# EAGLE design watchdog timer (EAGLE 6.5.0)
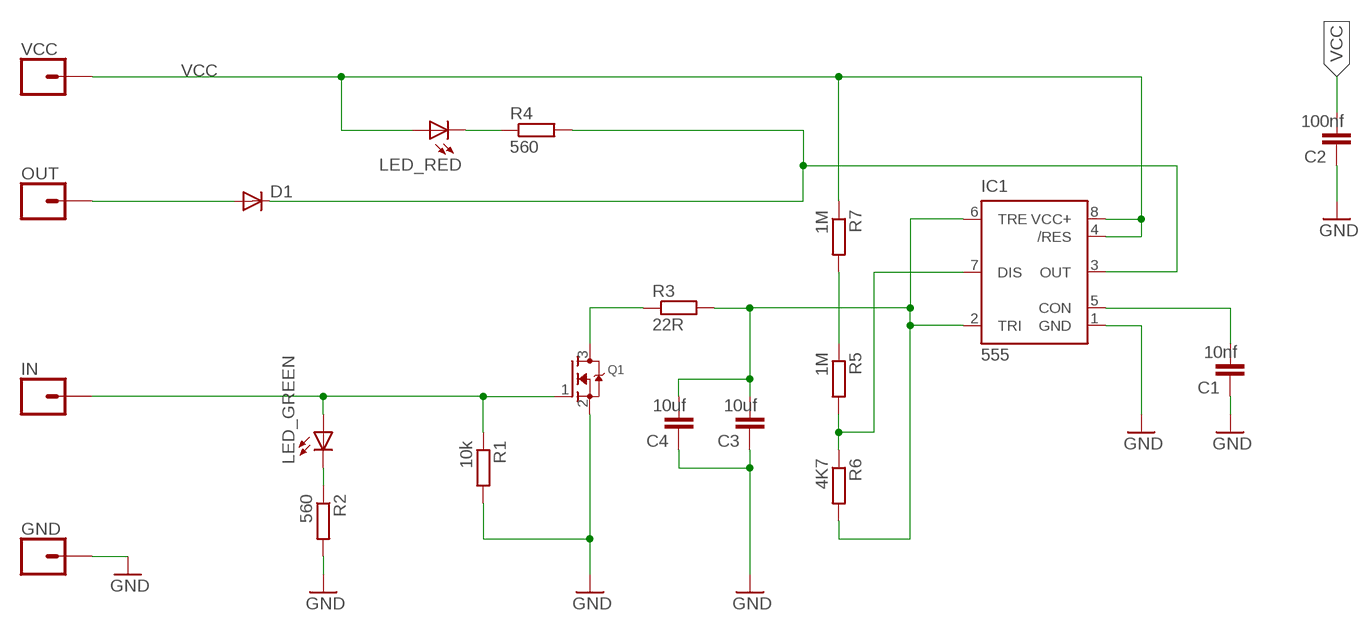
[diagram p0: schematic, sheet 1]

## Parts
C1  10nf  C-EUC1206  [C1206]
C2  100nf  C-EUC1206  [C1206]
C3  10uf  C-EUC1206  [C1206]
C4  10uf  C-EUC1206  [C1206]
D1  DIODE-SOD323-W  [SOD323-W]
GND  CONN_01  [1X01]
IC1  555  555D  [SO08]
IN  CONN_01  [1X01]
LED_GREEN  LEDSML0805  [SML0805]
LED_RED  LEDSML0805  [SML0805]
OUT  CONN_01  [1X01]
Q1  MOSFET-NREFLOW  [SOT23]
R1  10k  R-EU_M0805  [M0805]
R2  560  R-EU_M0805  [M0805]
R3  22R  R-EU_M0805  [M0805]
R4  560  R-EU_M0805  [M0805]
R5  1M  R-EU_M0805  [M0805]
R6  4K7  R-EU_M0805  [M0805]
R7  1M  R-EU_M0805  [M0805]
VCC  CONN_01  [1X01]

## Nets
GND: C1.1 C2.1 C3.1 C4.1 GND.1 IC1.1(GND) Q1.2(S) R1.2 R2.2
IN: IN.1 LED_GREEN.A Q1.1(G) R1.1
N$1: IC1.7(DIS) R5.2 R6.1
N$2: LED_GREEN.C R2.1
N$3: R5.1 R7.2
N$4: D1.A OUT.1
N$5: C1.2 IC1.5(CON)
N$6: D1.C IC1.3(OUT) R4.2
N$8: Q1.3(D) R3.1
N$9: C3.2 C4.2 IC1.2(TRI) IC1.6(TRE) R3.2 R6.2
N$11: LED_RED.C R4.1
VCC: C2.2 IC1.4(/RES) IC1.8(VCC+) LED_RED.A R7.1 VCC.1

## Library data of the parts
C1-C4 = rcl:C-EU: CAPACITOR, European symbol
D1 = diode:DIODE-: DIODE
GND IN OUT VCC = SparkFun-Connectors:CONN_01: Single connection point. Often used as Generic Header-pin footprint for 0.1 inch spaced/style header connections On any of the 0.1 inch spaced packages, you can populate with these: Break Away Headers - Straight <https://www.sparkfun.com/products/116> (PRT-00116) Break Away Male Headers - Right Angle <https://www.sparkfun.com/products/553> (PRT-00553) Female Headers <https://www.sparkfun.com/products/115> (PRT-00115) Break Away Headers - Machine Pin <https://www.sparkfun.com/products/117> (PRT-00117) Break Away Female Headers - Swiss Machine Pin <https://www.sparkfun.com/products/743> (PRT-00743) This device is also useful as a general connection point to wire up your design to another part of your project. Our various solder wires solder well into these plated through hole pads. Hook-Up Wire - Assortment (Stranded, 22 AWG) <https://www.sparkfun.com/products/11375> (PRT-11375) Hook-Up Wire - Assortment (Solid Core, 22 AWG) <https://www.sparkfun.com/products/11367> (PRT-11367) View the entire wire category on our website here <https://www.sparkfun.com/categories/141> Special notes: SMTSO-256-ET is a "flush mount" nut for a 4-40 screw. We mostly use this on specialty testbeds; it is a nice way to connect hardware to your PCB at an adjustable hieght. Also note, the SNAP packages are for using a snappable style connector. We sell a baggie of snaps and they are also used on two LilyPad designs: Snap Assortment - 30 pack (male and female) <https://www.sparkfun.com/products/11347> (DEV-11347) LilyPad Arduino SimpleSnap <https://www.sparkfun.com/products/10941> (DEV-10941) LilyPad SimpleSnap Protoboard <https://www.sparkfun.com/products/10940> (DEV-10940)
IC1 = SparkFun-IC-Special-Function:555: General purpose bipolar Timer Datasheet <http://www.sparkfun.com/datasheets/Components/General/ne555.pdf> SparkFun Products SparkFun SparkPunk Sequencer Kit <https://www.sparkfun.com/products/12707> (KIT-12707) Storefront Component: 555 Timer <https://www.sparkfun.com/products/9273> (COM-09273) Two parts valid for production: VFP: IC-11930 (M7555 PTH) VFP: IC-09173 (555 PTH) - Preferred; PROD_ID: NA-XXXXX
LED_GREEN LED_RED = led:LED: LED OSRAM: - CHIPLED LG R971, LG N971, LY N971, LG Q971, LY Q971, LO R971, LY R971 LH N974, LH R974 LS Q976, LO Q976, LY Q976 LO Q996 - Hyper CHIPLED LW Q18S LB Q993, LB Q99A, LB R99A - SideLED LS A670, LO A670, LY A670, LG A670, LP A670 LB A673, LV A673, LT A673, LW A673 LH A674 LY A675 LS A676, LA A676, LO A676, LY A676, LW A676 LS A679, LY A679, LG A679 - Hyper Micro SIDELED® LS Y876, LA Y876, LO Y876, LY Y876 LT Y87S - SmartLED LW L88C, LW L88S LB L89C, LB L89S, LG L890 LS L89K, LO L89K, LY L89K LS L896, LA L896, LO L896, LY L896 - TOPLED LS T670, LO T670, LY T670, LG T670, LP T670 LSG T670, LSP T670, LSY T670, LOP T670, LYG T670 LG T671, LOG T671, LSG T671 LB T673, LV T673, LT T673, LW T673 LH T674 LS T676, LA T676, LO T676, LY T676, LB T676, LH T676, LSB T676, LW T676 LB T67C, LV T67C, LT T67C, LS T67K, LO T67K, LY T67K, LW E67C LS E67B, LA E67B, LO E67B, LY E67B, LB E67C, LV E67C, LT E67C LW T67C LS T679, LY T679, LG T679 LS T770, LO T770, LY T770, LG T770, LP T770 LB T773, LV T773, LT T773, LW T773 LH T774 LS E675, LA E675, LY E675, LS T675 LS T776, LA T776, LO T776, LY T776, LB T776 LHGB T686 LT T68C, LB T68C - Hyper Mini TOPLED® LB M676 - Mini TOPLED Santana® LG M470 LS M47K, LO M47K, LY M47K Source: http://www.osram.convergy.de LUXEON: - LUMILED® LXK2-PW12-R00, LXK2-PW12-S00, LXK2-PW14-U00, LXK2-PW14-V00 LXK2-PM12-R00, LXK2-PM12-S00, LXK2-PM14-U00 LXK2-PE12-Q00, LXK2-PE12-R00, LXK2-PE12-S00, LXK2-PE14-T00, LXK2-PE14-U00 LXK2-PB12-K00, LXK2-PB12-L00, LXK2-PB12-M00, LXK2-PB14-N00, LXK2-PB14-P00, LXK2-PB14-Q00 LXK2-PR12-L00, LXK2-PR12-M00, LXK2-PR14-Q00, LXK2-PR14-R00 LXK2-PD12-Q00, LXK2-PD12-R00, LXK2-PD12-S00 LXK2-PH12-R00, LXK2-PH12-S00 LXK2-PL12-P00, LXK2-PL12-Q00, LXK2-PL12-R00 Source: www.luxeon.com KINGBRIGHT: KA-3528ASYC Source: www.kingbright.com
Q1 = adafruit:MOSFET-N: N-Channel Mosfet 2N7002E - 60V 260mA SOT23 [Digikey: 2N7002ET1GOSTR-ND] - REEL BSH103 - 30V 850mA SOT23 [Digikey: 568-5013-1-ND]
R1-R7 = rcl:R-EU_: RESISTOR, European symbol

## Board
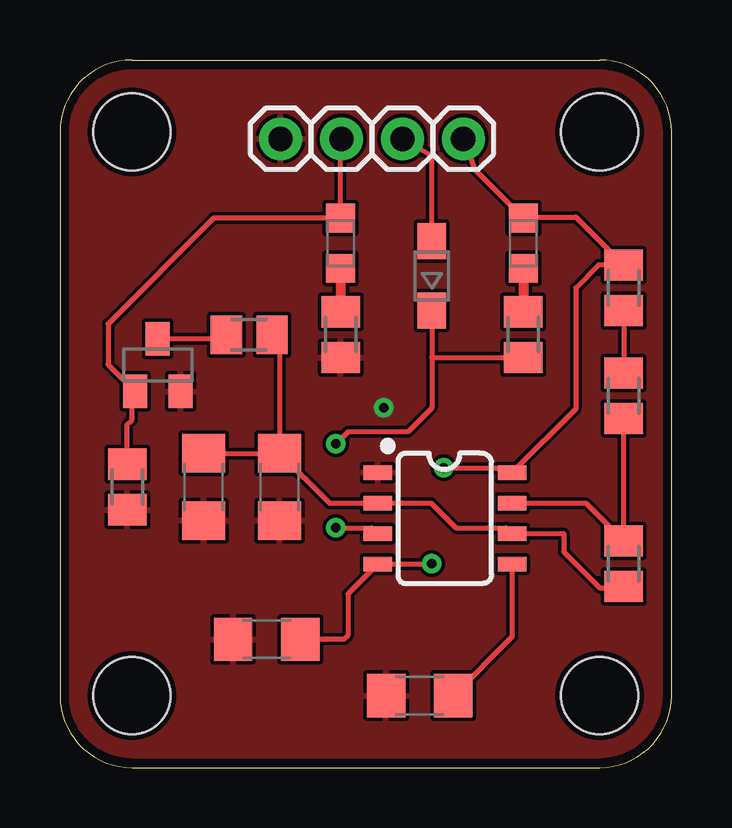
[diagram p1: board, top side]
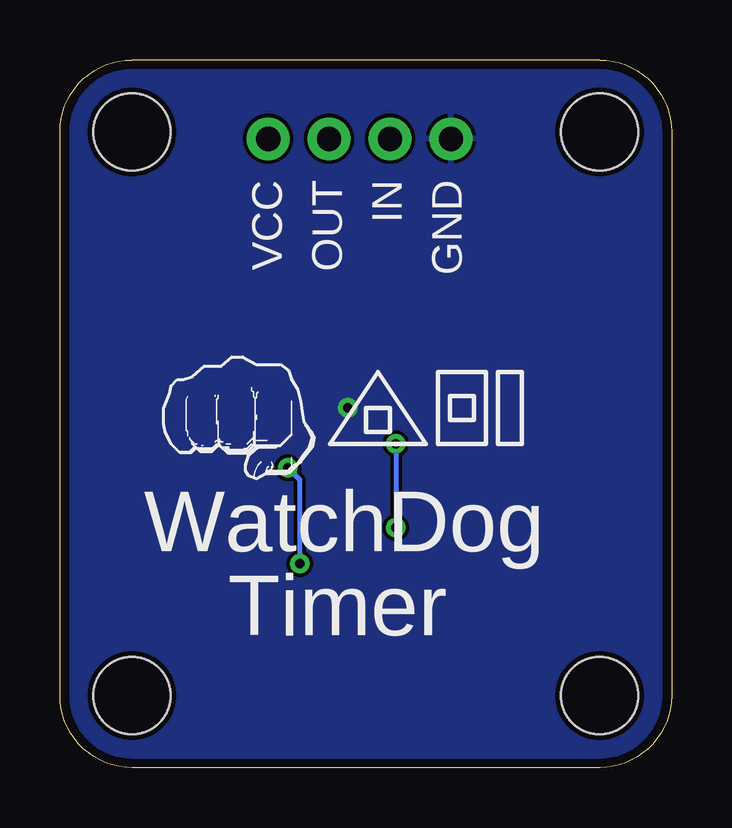
[diagram p2: board, bottom side, seen from below]

Size 25.5 x 29.5 mm. Coordinates in mm from the lower left corner, seen from the top.
Outline: 3,0 22.5,0 arc90 25.5,3 25.5,26.5 arc90 22.5,29.5 3,29.5 arc90 0,26.5 0,3 arc90 3,0
Copper layers (1*16): Top 0.035mm / dielectric 1.5mm / Bottom 0.035mm
Design rules "SeeedStudio_2layer_DRU_no_angle_20140221 *": minimum track width 6mil, minimum drill 12mil, track to track 6mil, track to pad 6mil, pad to pad 6mil, via to via 6mil, smd to smd 0mil, copper to edge 10mil, drill to drill 10mil, minimum pad ring 10mil, minimum via ring 6mil, stop-mask expansion 2mil, vias tented up to drill 100mil, thermal gap 6mil
Holes 3.2 mm at 3,3 3,26.5 22.5,26.5 22.5,3

### Footprints (pad centres in the part's own frame; a part is rotated, then mirrored left to right if it is on the bottom)
C1206 = smd 1.6 x 1.8: 1 -1.4,0; 2 1.4,0
SOD323-W = smd 1.5 x 1.2: A 1.45,0; C -1.45,0
1X01 = drill 1.016 pad 1.778: 1 0,0
SO08 = smd 0.6 x 1.2: 1 -1.905,-2.8; 2 -0.635,-2.8; 3 0.635,-2.8; 4 1.905,-2.8; 5 1.905,2.8; 6 0.635,2.8; 7 -0.635,2.8; 8 -1.905,2.8
SML0805 = smd 1.2 x 1.2: A 1.05,0; C -1.05,0
SOT23 = smd 1 x 1.4: 1 -0.95,-1.1; 2 0.95,-1.1; 3 0,1.1
M0805 = smd 1.3 x 1.6: 1 -0.95,0; 2 0.95,0

### Placement (x,y rotation side)
C1  15,3 0 top
C2  8.62,5.35 0 top
C3  9.16,11.7 90 top
C4  5.99,11.7 90 top
D1  15.5,20.5 90 top
GND  9.2,26.21 0 top
IC1  16.05,10.39 270 top
IN  11.74,26.21 0 top
LED_GREEN  11.7,21.86 90 top
LED_RED  19.32,21.86 90 top
OUT  14.28,26.21 0 top
Q1  4.08,16.78 0 top
R1  2.81,11.7 270 top
R2  11.7,18.05 270 top
R3  7.89,18.05 0 top
R4  19.32,18.05 270 top
R5  23.5,15.5 270 top
R6  23.5,8.5 270 top
R7  23.5,20 270 top
U$1  [ADILOGO]  13.5,13.5 0 bottom
VCC  16.82,26.21 0 top

### Tracks (layer width: path | path; a pad name or v marks a point on that pad's centre or on a via)
GND  (via drill 0.38 pad 0.81)
  other vias: 13.5,15
  pour Top (isolate 0.152): 12,0.5 3,0.5 arc-90 0.5,3 0.5,26.5 arc-90 3,29 22.5,29 arc-90 25,26.5 25,3 arc-90 22.5,0.5
  pour Bottom (isolate 0.152): 14.5,0.5 3,0.5 arc-90 0.5,3 0.5,26.5 arc-90 3,29 22.5,29 arc-90 25,26.5 25,3 arc-90 22.5,0.5
IN
  Top 0.203: R1.1 2.81,14.31 3,14.5 3,15.55 Q1.1 2,16.81 2,18.5 6.41,22.91 LED_GREEN.A 11.7,25.67 IN.1
N$1
  Top 0.203: R5.2 R6.1 21.93,11.03 IC1.7
N$2
  Top 0.406: LED_GREEN.C R2.1
N$3
  Top 0.203: R7.2 R5.1
N$4
  Top 0.203: D1.A 15.5,25.49 OUT.1
N$5
  Top 0.203: IC1.5 18.85,5.45 C1.2
N$6  (via drill 0.38 pad 0.81)
  Top 0.203: D1.C 15.5,17.1 | 15.5,17.1 R4.2 | 15.5,17.1 15.5,15 14.5,14 12,14 v11.5,13.5 | v11.5,10 13.01,10 IC1.3
  Bottom 0.203: v11.5,13.5 v11.5,10
N$8
  Top 0.203: Q1.3 6.94,17.88
  Top 0.406: 6.94,17.88 R3.1
N$9
  Top 0.203: 9.16,18.05 C3.2 | C4.2 C3.2 | C3.2 11.23,11.03 IC1.2 15.47,11.03 16.5,10 18.61,10 IC1.6 21,9.76 21,9 22.5,7.5 23.45,7.5 R6.2
  Top 0.406: R3.2 9.16,18.05
N$11
  Top 0.406: LED_RED.C R4.1
VCC  (via drill 0.38 pad 0.81)
  Top 0.203: LED_RED.A 17.32,24.91 VCC.1 | 19.36,22.95 21.5,22.95 R7.1 22.45,20.95 21.5,20 21.5,14.95 IC1.8 18.64,12.5 v16,12.5 | C2.2 11.85,5.35 12,5.5 12,7.24 IC1.4 15.48,8.48 v15.5,8.5
  Top 0.254: LED_RED.A 19.36,22.95
  Bottom 0.203: v15.5,8.5 15.5,12 v16,12.5

### Text on the board
bNames: GND | IN | OUT | VCC | WatchDog | Timer